# EAGLE schematic SensorCircuits2 (EAGLE 6.5.0)
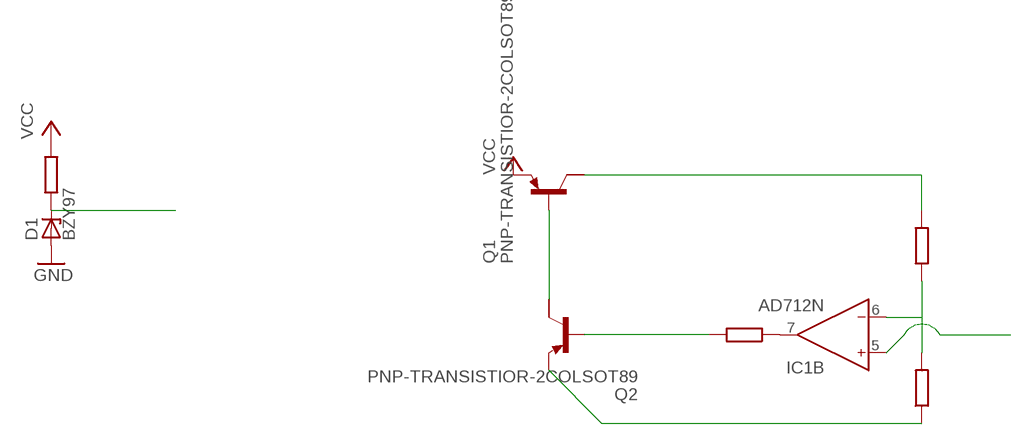
[diagram p0: schematic, sheet 1]

## Parts
D1  BZY97  [F126Z12]
IC1  AD712N  [DIL08]
Q1  PNP-TRANSISTIOR-2COLSOT89  [SOT89]
Q2  PNP-TRANSISTIOR-2COLSOT89  [SOT89]

## Nets
GND: D1.A
N$1: D1.C
N$2: Q1.2(C)
N$3: Q1.1(B) Q2.2(C)
N$4: IC1.6(B:IN-)
N$5: Q2.3(E)
N$6: IC1.5(B:IN+)
N$7: Q2.1(B)
VCC: Q1.3(E)
Unconnected: IC1.1(A:OUT) IC1.2(A:IN-) IC1.3(A:IN+) IC1.7(B:OUT) Q1.2@1(C/) Q2.2@1(C/)

## Power pins joined to a net without a drawn wire
V+: IC1.8(P:V+)
V-: IC1.4(P:V-)

## Library data of the parts
D1 = diode:BZY97: Z DIODE
IC1 = analog-devices:AD712: Dual Precision, Low Cost, High Speed BiFET Op Amp Source: http://www.analog.com/static/imported-files/data_sheets/AD712.pdf; MF: ALTERA CORPORATION; MPN: AD712JNZ; OC_FARNELL: 9604898; OC_NEWARK: 59K4554
Q1 Q2 = semicon-smd-ipc:PNP-TRANSISTIOR-2COL: PNP TRANSISTOR 2 colletor pins